# EAGLE design greenhouse huzah feather (EAGLE 9.6.2)
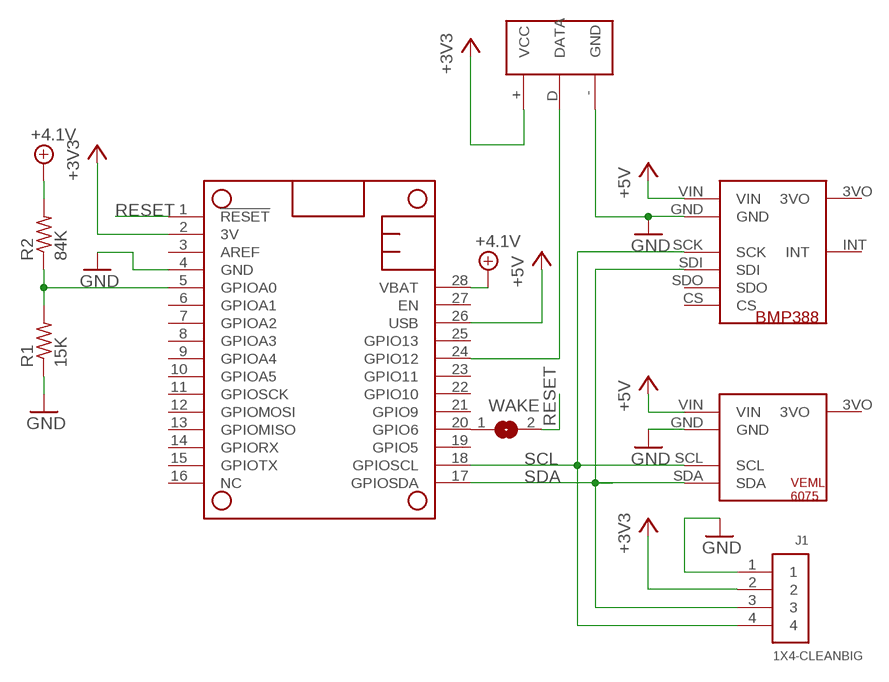
[diagram p0: schematic, sheet 1]

## Parts
J1  1X4-CLEANBIG  [1X04-CLEANBIG]
MS1  FEATHERWING  [FEATHERWING]
R1  15K  R-US_R0805  [R0805]
R2  84K  R-US_R0805  [R0805]
U$1  ADA_BMP388  [ADA_BMP388]
U$2  ADA_VEML6075  [ADA_VEML6075]
U$4  DHT11  [DHT22_DAUGHTER]
WAKE  SJ  [SJ]

## Nets
+3V3: J1.2 MS1.2(3V) U$4.+(VCC)
+4.1V: MS1.28(VBAT) R2.2
+5V: MS1.26(USB) U$1.VIN U$2.VIN
GND: J1.1 MS1.4(GND) R1.1 U$1.GND U$2.GND U$4.-(GND)
N$1: MS1.20(GPIO6) WAKE.1
N$3: MS1.5(GPIOA0) R1.2 R2.1
N$5: MS1.24(GPIO12) U$4.D(DATA)
RESET: MS1.1(!RESET) WAKE.2
SCL: J1.4 MS1.18(GPIOSCL) U$1.SCK U$2.SCL
SDA: J1.3 MS1.17(GPIOSDA) U$1.SDI U$2.SDA
Unconnected: MS1.3(AREF) MS1.6(GPIOA1) MS1.7(GPIOA2) MS1.8(GPIOA3) MS1.9(GPIOA4) MS1.10(GPIOA5) MS1.11(GPIOSCK) MS1.12(GPIOMOSI) MS1.13(GPIOMISO) MS1.14(GPIORX) MS1.15(GPIOTX) MS1.16(NC) MS1.19(GPIO5) MS1.21(GPIO9) MS1.22(GPIO10) MS1.23(GPIO11) MS1.25(GPIO13) MS1.27(EN) U$1.3VO U$1.CS U$1.INT U$1.SDO U$2.3VO

## Library data of the parts
J1 = adafruit:1X4: 4-pin connector
MS1 = adafruit:FEATHERWING
R1 R2 = rcl:R-US_: RESISTOR, American symbol; SPICEPREFIX: R
U$1 = DZ:ADA_BMP388
U$2 = DZ:ADA_VEML6075
U$4 = DZ:DHT11
WAKE = jumper:SJ: SMD solder JUMPER

## Board
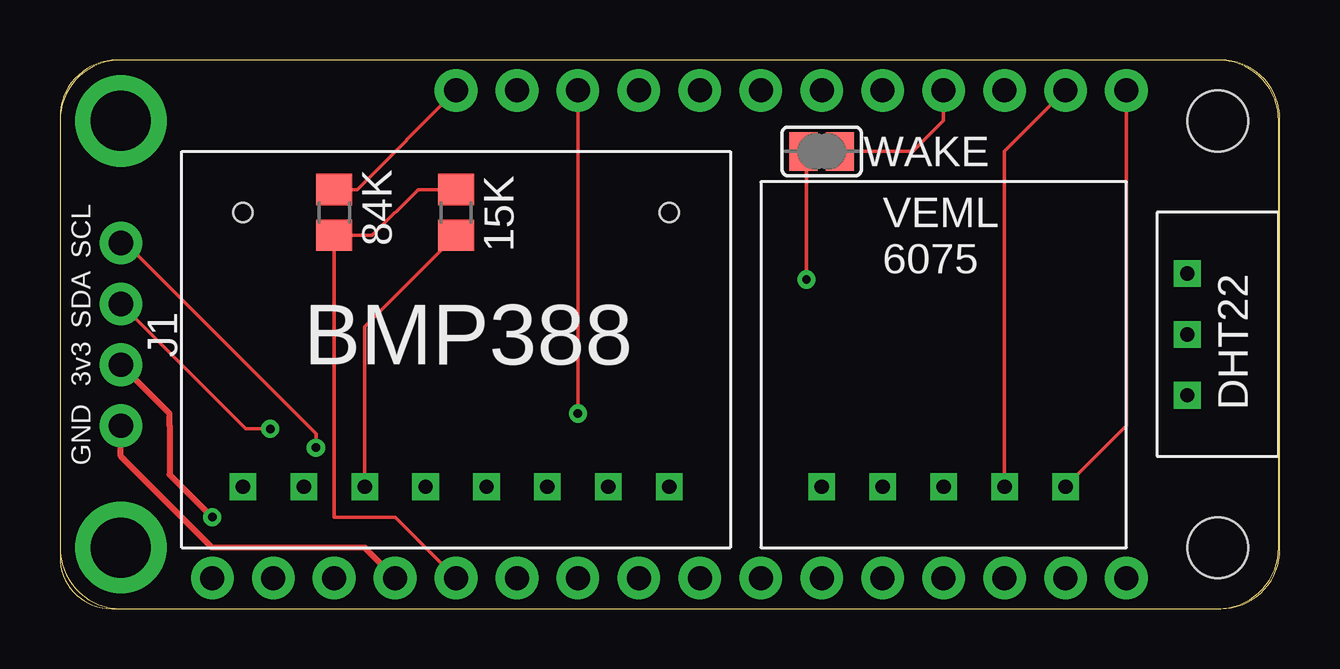
[diagram p1: board, top side]
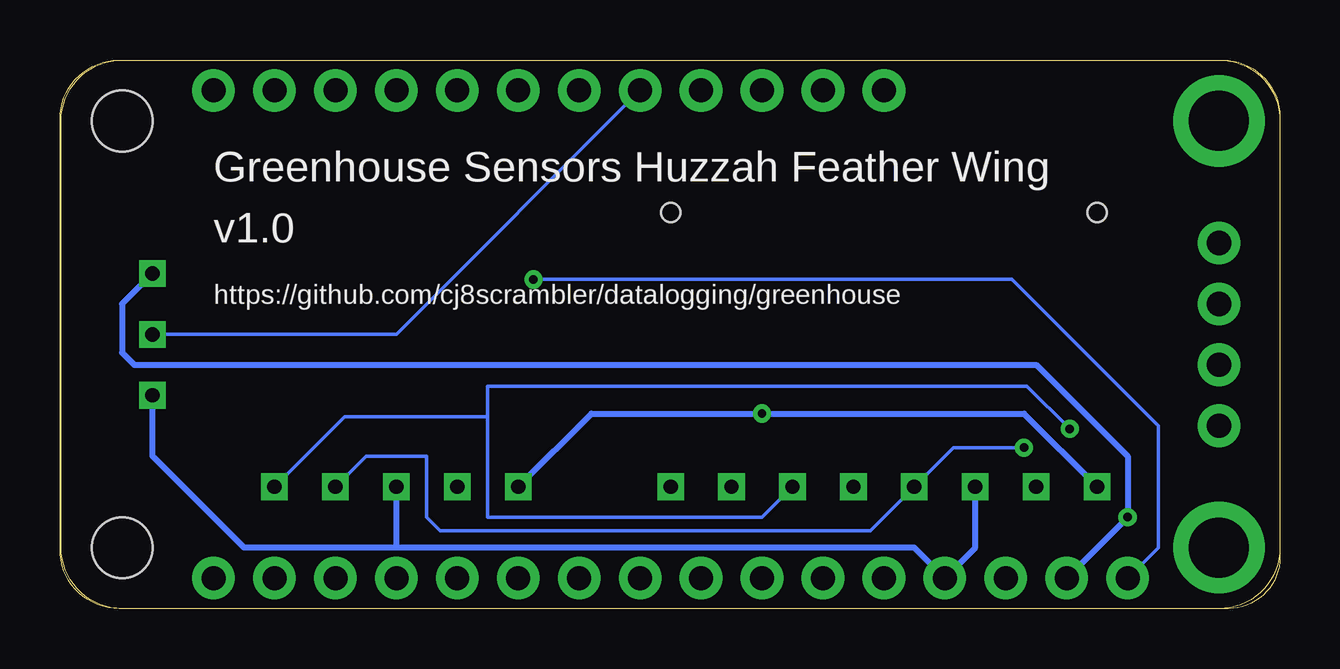
[diagram p2: board, bottom side, seen from below]

Size 50.85 x 22.86 mm. Coordinates in mm from the lower left corner, seen from the top.
Outline: 0,20.49 0,2.15 arc90 2.15,0 48.39,0 arc90 50.85,2.46 50.85,20.4 arc90 48.4,22.85 2.36,22.85 arc90 0,20.49
Copper layers (1*16): Top 0.035mm / dielectric 1.5mm / Bottom 0.035mm
Design rules "default": minimum track width 6mil, minimum drill 0.35mm, track to track 6mil, track to pad 6mil, pad to pad 6mil, via to via 6mil, smd to smd 6mil, copper to edge 40mil, drill to drill 6mil, minimum pad ring 10mil, minimum via ring 8mil, stop-mask expansion 4mil, vias tented up to drill 0mil, thermal gap 10mil

### Footprints (pad centres in the part's own frame; a part is rotated, then mirrored left to right if it is on the bottom)
1X04-CLEANBIG = drill 1.016 pad 1.778: 1 -3.81,0; 2 -1.27,0; 3 1.27,0; 4 3.81,0
FEATHERWING = drill 1 pad 1.778: 1 6.35,1.27; 2 8.89,1.27; 3 11.43,1.27; 4 13.97,1.27; 5 16.51,1.27; 6 19.05,1.27; 7 21.59,1.27; 8 24.13,1.27; 9 26.67,1.27; 10 29.21,1.27; 11 31.75,1.27; 12 34.29,1.27; 13 36.83,1.27; 14 39.37,1.27; 15 41.91,1.27; 16 44.45,1.27; 17 44.45,21.59; 18 41.91,21.59; 19 39.37,21.59; 20 36.83,21.59; 21 34.29,21.59; 22 31.75,21.59; 23 29.21,21.59; 24 26.67,21.59; 25 24.13,21.59; 26 21.59,21.59; 27 19.05,21.59; 28 16.51,21.59 | drill 2.5 pad 3.81: P$1 2.54,20.32; P$2 2.54,2.54 | hole 2.54: 48.26,20.32; 48.26,2.54
R0805 = smd 1.3 x 1.5: 1 -0.95,0; 2 0.95,0
ADA_BMP388 = drill 0.6 square: 3VO -6.35,-8.89; CS 6.35,-8.89; GND -3.81,-8.89; INT 8.89,-8.89; SCK -1.27,-8.89; SDI 3.81,-8.89; SDO 1.27,-8.89; VIN -8.89,-8.89 | hole 0.8: -8.89,2.54; 8.89,2.54
ADA_VEML6075 = drill 0.6 square: 3VO -2.54,-3.81; GND 0,-3.81; SCL 2.54,-3.81; SDA 5.08,-3.81; VIN -5.08,-3.81
DHT22_DAUGHTER = drill 0.6 square: + -2.54,-1.27; - 2.54,-1.27; D 0,-1.27
SJ = smd 1.168 x 1.6: 1 -0.762,0; 2 0.762,0

### Placement (x,y rotation side)
J1  2.54,11.43 90 top
MS1  0,0 0 top
R1  16.51,16.51 90 top
R2  11.43,16.51 90 top
U$1  16.51,13.97 0 top
U$2  36.83,8.89 0 top
U$4  48.26,11.43 270 top
WAKE  31.75,19.05 180 top

### Tracks (layer width: path | path; a pad name or v marks a point on that pad's centre or on a via)
+3V3  (via drill 0.35)
  Top 0.254: v6.35,3.81 4.57,5.59 4.57,7.62 4.57,7.65 4.57,8.13 J1.2
  Bottom 0.254: MS1.2 v6.35,3.81 6.35,6.35 10.16,10.16 47.75,10.16 48.26,10.67 48.26,12.7 U$4.+
+4.1V
  Top 0.152: MS1.28 12.38,17.46 R2.2
+5V  (via drill 0.35)
  Top 0.152: MS1.26 v21.59,8.13
  Bottom 0.254: U$2.VIN 28.7,8.13 v21.59,8.13 10.67,8.13 U$1.VIN
GND
  Top 0.152: R1.1 12.7,11.75 U$1.GND
  Top 0.254: MS1.4 12.7,2.54 6.35,2.54 2.54,6.35 J1.1
  Bottom 0.254: U$1.GND 12.7,2.54 MS1.4 15.24,2.54 36.83,2.54 | 36.83,2.54 43.18,2.54 46.99,6.35 U$4.- | 36.83,2.54 U$2.GND
N$1
  Top 0.152: WAKE.1 35.56,19.05 36.83,20.32 MS1.20
N$3
  Top 0.152: MS1.5 13.97,3.81 11.43,3.81 R2.1 13.02,15.56 14.92,17.46 R1.2
N$5
  Bottom 0.152: U$4.D 36.83,11.43 MS1.24
RESET  (via drill 0.35)
  Top 0.152: v31.11,13.72 31.11,18.92 WAKE.2
  Bottom 0.152: MS1.1 5.08,2.54 5.08,7.62 11.18,13.72 v31.11,13.72
SCL  (via drill 0.35)
  Top 0.152: MS1.18 39.37,19.05 U$2.SCL | v10.67,6.71 10.67,7.28 2.71,15.24 J1.4
  Bottom 0.152: U$2.SCL 38.1,6.35 35.56,6.35 35.56,3.81 35,3.25 17.07,3.25 U$1.SCK 13.61,6.71 v10.67,6.71
SDA  (via drill 0.35)
  Top 0.152: U$2.SDA 44.45,7.62 MS1.17 | J1.3 7.75,7.49 v8.76,7.49
  Bottom 0.152: U$2.SDA 38.99,8 33.02,8 | 33.02,8 33.02,3.81 21.59,3.81 U$1.SDI | 33.02,8 33.02,9.27 10.54,9.27 v8.76,7.49

### Text on the board
tPlace: SCL | SDA | 3v3 | GND
bPlace: Greenhouse Sensors Huzzah Feather Wing | v1.0 | https://github.com/cj8scrambler/datalogging/greenhouse